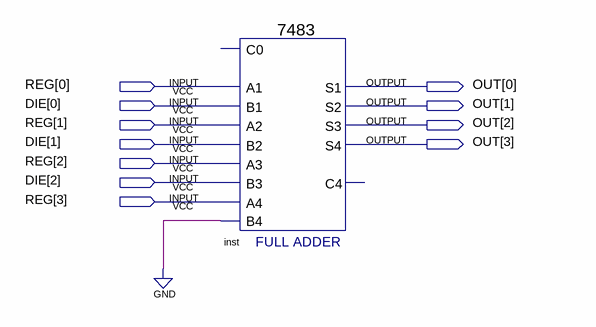
[diagram p0: schematic sheet]
// Quartus schematic ADDER.bdf as structural Verilog: 1 symbols, 11 pins
module ADDER (
  input  [3:0] REG,
  input  [2:0] DIE,
  output [3:0] OUT
);

  \7483  inst (
    .B4(1'b0), .A1(REG[0]), .A2(REG[1]), .B1(DIE[0]), .B2(DIE[1]), .A3(REG[2]), .B3(DIE[2]), .A4(REG[3]),
    .S3(OUT[2]), .S4(OUT[3]), .S2(OUT[1]), .S1(OUT[0]));  // open: C0, C4
endmodule
